# Altium schematic sheet saida_rele.SchDoc
size A4
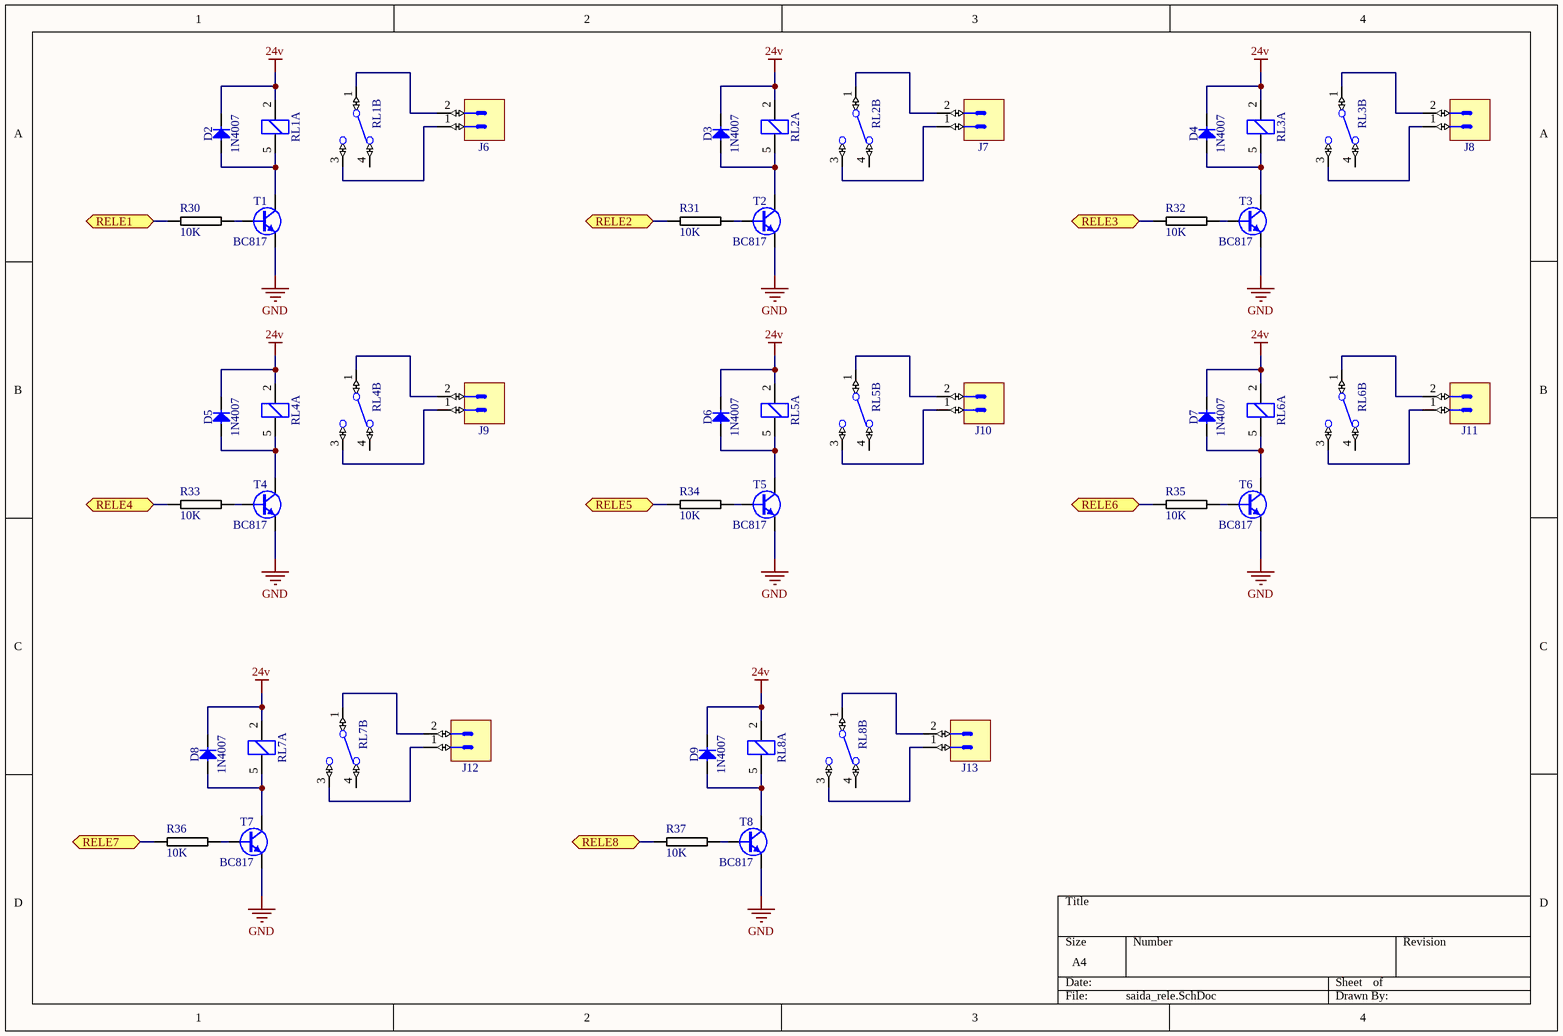
[diagram p0: saida_rele.SchDoc]

## Parts
D2  1N4007  [DO-41]
D3  1N4007  [DO-41]
D4  1N4007  [DO-41]
D5  1N4007  [DO-41]
D6  1N4007  [DO-41]
D7  1N4007  [DO-41]
D8  1N4007  [DO-41]
D9  1N4007  [DO-41]
J6  (no value)  [PHOENIX_1757242]
J7  (no value)  [PHOENIX_1757242]
J8  (no value)  [PHOENIX_1757242]
J9  (no value)  [PHOENIX_1757242]
J10  (no value)  [PHOENIX_1757242]
J11  (no value)  [PHOENIX_1757242]
J12  (no value)  [PHOENIX_1757242]
J13  (no value)  [PHOENIX_1757242]
R30  10K  [0805R-10K]
R31  10K  [0805R-10K]
R32  10K  [0805R-10K]
R33  10K  [0805R-10K]
R34  10K  [0805R-10K]
R35  10K  [0805R-10K]
R36  10K  [0805R-10K]
R37  10K  [0805R-10K]
RL1  5VDC  [REL_PANASONIC_JS1]  (value not drawn)  (parts A,B of 2)
RL2  5VDC  [REL_PANASONIC_JS1]  (value not drawn)  (parts A,B of 2)
RL3  5VDC  [REL_PANASONIC_JS1]  (value not drawn)  (parts A,B of 2)
RL4  5VDC  [REL_PANASONIC_JS1]  (value not drawn)  (parts A,B of 2)
RL5  5VDC  [REL_PANASONIC_JS1]  (value not drawn)  (parts A,B of 2)
RL6  5VDC  [REL_PANASONIC_JS1]  (value not drawn)  (parts A,B of 2)
RL7  5VDC  [REL_PANASONIC_JS1]  (value not drawn)  (parts A,B of 2)
RL8  5VDC  [REL_PANASONIC_JS1]  (value not drawn)  (parts A,B of 2)
T1  BC817  [SOT95P230X110-3N]
T2  BC817  [SOT95P230X110-3N]
T3  BC817  [SOT95P230X110-3N]
T4  BC817  [SOT95P230X110-3N]
T5  BC817  [SOT95P230X110-3N]
T6  BC817  [SOT95P230X110-3N]
T7  BC817  [SOT95P230X110-3N]
T8  BC817  [SOT95P230X110-3N]

## Ports
RELE1, RELE2, RELE3, RELE4, RELE5, RELE6, RELE7, RELE8

## Nets
24v: D2.1(C) D3.1(C) D4.1(C) D5.1(C) D6.1(C) D7.1(C) D8.1(C) D9.1(C) RL1.2(COIL) RL2.2(COIL) RL3.2(COIL) RL4.2(COIL) RL5.2(COIL) RL6.2(COIL) RL7.2(COIL) RL8.2(COIL)
GND: T1.2(E) T2.2(E) T3.2(E) T4.2(E) T5.2(E) T6.2(E) T7.2(E) T8.2(E)
RELE1: R30.1 ; port RELE1
RELE2: R31.1 ; port RELE2
RELE3: R32.1 ; port RELE3
RELE4: R33.1 ; port RELE4
RELE5: R34.1 ; port RELE5
RELE6: R35.1 ; port RELE6
RELE7: R36.1 ; port RELE7
RELE8: R37.1 ; port RELE8
NetD2_2: D2.2(A) RL1.5(COIL) T1.3(C)
NetD3_2: D3.2(A) RL2.5(COIL) T2.3(C)
NetD4_2: D4.2(A) RL3.5(COIL) T3.3(C)
NetD5_2: D5.2(A) RL4.5(COIL) T4.3(C)
NetD6_2: D6.2(A) RL5.5(COIL) T5.3(C)
NetD7_2: D7.2(A) RL6.5(COIL) T6.3(C)
NetD8_2: D8.2(A) RL7.5(COIL) T7.3(C)
NetD9_2: D9.2(A) RL8.5(COIL) T8.3(C)
NetJ6_1: J6.1 RL1.3(NO)
NetJ6_2: J6.2 RL1.1(C)
NetJ7_1: J7.1 RL2.3(NO)
NetJ7_2: J7.2 RL2.1(C)
NetJ8_1: J8.1 RL3.3(NO)
NetJ8_2: J8.2 RL3.1(C)
NetJ9_1: J9.1 RL4.3(NO)
NetJ9_2: J9.2 RL4.1(C)
NetJ10_1: J10.1 RL5.3(NO)
NetJ10_2: J10.2 RL5.1(C)
NetJ11_1: J11.1 RL6.3(NO)
NetJ11_2: J11.2 RL6.1(C)
NetJ12_1: J12.1 RL7.3(NO)
NetJ12_2: J12.2 RL7.1(C)
NetJ13_1: J13.1 RL8.3(NO)
NetJ13_2: J13.2 RL8.1(C)
NetR30_2: R30.2 T1.1(B)
NetR31_2: R31.2 T2.1(B)
NetR32_2: R32.2 T3.1(B)
NetR33_2: R33.2 T4.1(B)
NetR34_2: R34.2 T5.1(B)
NetR35_2: R35.2 T6.1(B)
NetR36_2: R36.2 T7.1(B)
NetR37_2: R37.2 T8.1(B)

Not connected (* = marked no-connect by the designer): RL1 4(NC); RL2 4(NC); RL3 4(NC); RL4 4(NC); RL5 4(NC); RL6 4(NC); RL7 4(NC); RL8 4(NC)

## Library data of the parts
D2-D9 = 1N4007: Diode; Part Description: Axial Lead Standard Recovery Rectifier; Manufacturer: FAIRCHILD SEMICONDUCTOR; Voltage: 1000V; Power: 1A; Table: Diodes; Part Number: 1N4007; Component Kind: Standard; Component Type: Standard; Device: 1N4007; PackageDescription: DO-41, Diode, Axial, Body 4.7 x 2.7mm (LxDia. Max), Pin spacing 10.16mm; Manufacturer Part Number: 1N4007; Pin Count: 2; Case: DO-41; Mounted: Yes; Socket: No; SMD: No; ComponentHeight: 2.72mm; HelpURL: \\cern.ch\dfs\Applications\Altium\Datasheets\1N4007.pdf; ComponentLink1URL: \\cern.ch\dfs\Applications\Altium\Datasheets\1N4007_Package.pdf; ComponentLink1Description: Package Drawing; Author: CERN DEM JLC; CreateDate: 20/08/2008; LatestRevisionDate: 30/10/2013
J6-J13 = PHOENIX_1757242: Connector 2 Male; Part Description: 12A, 250V, Pitch 5.08mm, 2 Positions Header; Manufacturer: PHOENIX CONTACT; Manufacturer Part Number: 1757242 (MSTBA 2,5/ 2-G-5,08); Part Number: PHOENIX_1757242; Component Kind: Standard; Component Type: Standard; Pin Count: 2; Mounted: Yes; Socket: No; SMD: No; Status: None; ComponentHeight: 8.6mm; HelpURL: \\cern.ch\dfs\Applications\Altium\Datasheets\PHOENIX_1757242.pdf; Author: CERN DEM JLC; CreateDate: 10/02/2010; LatestRevisionDate: 26/04/2010; Table: PHOENIX
R30-R37 = 0805R-10K: RESISTOR 0805 1/4 WATT THIN FILM; Reel: *
RL1-RL8 = REL_PANASONIC_JS1-5V-F: 10A SPDT PCB Relay, JS Serie; Part Description: 10A/250VAC SPDT (1 Form C) Power Relay, JS Serie; Table: Relays; Part Number: REL_PANASONIC_JS1-5V-F; Component Kind: Standard; Component Type: Standard; Pin Count: 5; PackageDescription: 5 Leads Relay, Row Spacing 12 mm; Body 22mm x 16mm, JS Serie; Mounted: Yes; Socket: No; SMD: No; Status: None; Value: 5VDC; Manufacturer: PANASONIC; Manufacturer Part Number: JS1-5V-F; ComponentHeight: 16.3mm; HelpURL: \\cern.ch\dfs\Applications\Altium\Datasheets\REL_PANASONIC_JS.pdf; Author: CERN DEM JLC; CreateDate: 13/03/2013; LatestRevisionDate: 13/03/2013
T1-T8 = BC817: NPN Transistor; Part Description: 45V 500mA NPN General-Purpose Transistor; Manufacturer: NXP SEMICONDUCTORS; Table: Transistors; Part Number: BC817; Component Kind: Standard; Component Type: Standard; Device: BC817; PackageDescription: SOT23, 3 pin, Pitch 0.95mm - 1.3mm W X 2.9mm L X 1.1mm H, IPC Medium Density; Manufacturer Part Number: BC817; Pin Count: 3; Case: SOT23-3; Mounted: Yes; Socket: No; SMD: Yes; ComponentHeight: 1.1mm; HelpURL: \\cern.ch\dfs\Applications\Altium\Datasheets\BC817.pdf; Author: CERN DEM JLC; CreateDate: 12/05/2011; LatestRevisionDate: 12/05/2011